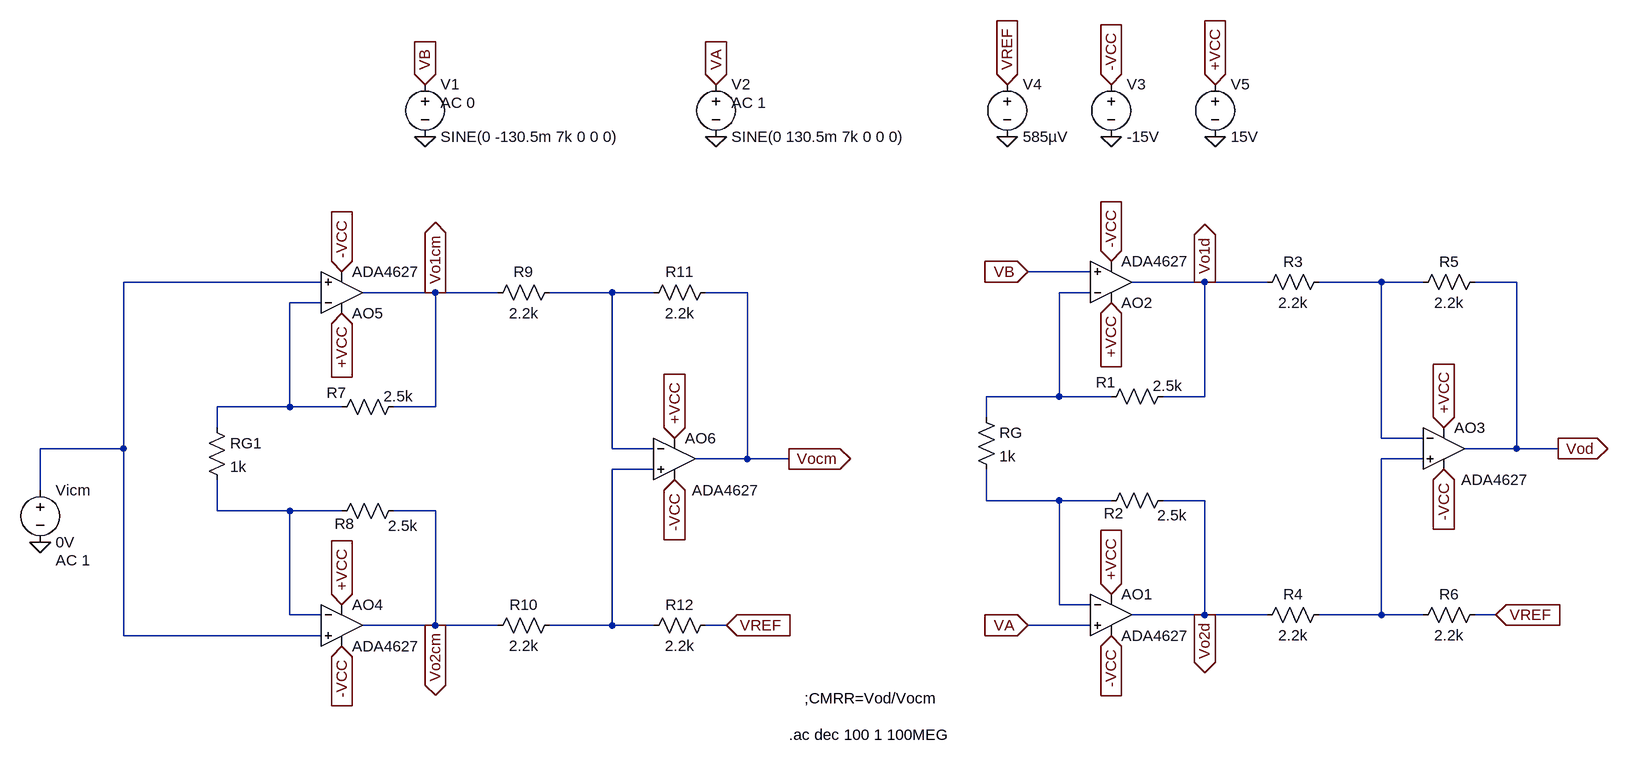
[diagram p0: schematic CMRR.asc]
CMRR.asc, the LTspice schematic file:
Version 4.1
SHEET 1 1332 680
WIRE -176 -80 -272 -80
WIRE -1360 -64 -1664 -64
WIRE 0 -64 -112 -64
WIRE 96 -64 0 -64
WIRE 272 -64 176 -64
WIRE 336 -64 272 -64
WIRE 480 -64 416 -64
WIRE -1184 -48 -1296 -48
WIRE -1088 -48 -1184 -48
WIRE -912 -48 -1008 -48
WIRE -848 -48 -912 -48
WIRE -704 -48 -768 -48
WIRE -176 -48 -224 -48
WIRE -1360 -32 -1408 -32
WIRE -224 112 -224 -48
WIRE -224 112 -336 112
WIRE -144 112 -224 112
WIRE 0 112 0 -64
WIRE 0 112 -64 112
WIRE -1408 128 -1408 -32
WIRE -1408 128 -1520 128
WIRE -1328 128 -1408 128
WIRE -1184 128 -1184 -48
WIRE -1184 128 -1248 128
WIRE -336 144 -336 112
WIRE -1520 160 -1520 128
WIRE 272 176 272 -64
WIRE 336 176 272 176
WIRE -1664 192 -1664 -64
WIRE -1664 192 -1792 192
WIRE -912 192 -912 -48
WIRE -848 192 -912 192
WIRE 480 192 480 -64
WIRE 480 192 400 192
WIRE 544 192 480 192
WIRE -704 208 -704 -48
WIRE -704 208 -784 208
WIRE -640 208 -704 208
WIRE 336 208 272 208
WIRE -848 224 -912 224
WIRE -1792 256 -1792 192
WIRE -336 272 -336 224
WIRE -224 272 -336 272
WIRE -144 272 -224 272
WIRE 0 272 -64 272
WIRE -1520 288 -1520 240
WIRE -1408 288 -1520 288
WIRE -1328 288 -1408 288
WIRE -1184 288 -1248 288
WIRE -224 432 -224 272
WIRE -176 432 -224 432
WIRE -1408 448 -1408 288
WIRE -1360 448 -1408 448
WIRE 0 448 0 272
WIRE 0 448 -112 448
WIRE 96 448 0 448
WIRE 272 448 272 208
WIRE 272 448 176 448
WIRE 336 448 272 448
WIRE 448 448 416 448
WIRE -1184 464 -1184 288
WIRE -1184 464 -1296 464
WIRE -1088 464 -1184 464
WIRE -912 464 -912 224
WIRE -912 464 -1008 464
WIRE -848 464 -912 464
WIRE -736 464 -768 464
WIRE -176 464 -272 464
WIRE -1664 480 -1664 192
WIRE -1360 480 -1664 480
FLAG -272 -80 VB
IOPIN -272 -80 In
FLAG -272 464 VA
IOPIN -272 464 In
FLAG -144 -96 -VCC
IOPIN -144 -96 In
FLAG -144 -32 +VCC
IOPIN -144 -32 In
FLAG -144 480 -VCC
IOPIN -144 480 In
FLAG -144 416 +VCC
IOPIN -144 416 In
FLAG 448 448 VREF
IOPIN 448 448 In
FLAG 0 -64 Vo1d
IOPIN 0 -64 Out
FLAG 0 448 Vo2d
IOPIN 0 448 Out
FLAG 368 224 -VCC
IOPIN 368 224 In
FLAG 368 160 +VCC
IOPIN 368 160 In
FLAG 544 192 Vod
IOPIN 544 192 Out
FLAG -1200 -288 0
FLAG -1200 -368 VB
IOPIN -1200 -368 In
FLAG -752 -288 0
FLAG -752 -368 VA
IOPIN -752 -368 In
FLAG -144 -288 0
FLAG 16 -288 0
FLAG 16 -368 +VCC
IOPIN 16 -368 In
FLAG -144 -368 -VCC
IOPIN -144 -368 In
FLAG -304 -288 0
FLAG -304 -368 VREF
IOPIN -304 -368 In
FLAG -1328 -80 -VCC
IOPIN -1328 -80 In
FLAG -1328 -16 +VCC
IOPIN -1328 -16 In
FLAG -1328 496 -VCC
IOPIN -1328 496 In
FLAG -1328 432 +VCC
IOPIN -1328 432 In
FLAG -736 464 VREF
IOPIN -736 464 In
FLAG -1184 -48 Vo1cm
IOPIN -1184 -48 Out
FLAG -1184 464 Vo2cm
IOPIN -1184 464 Out
FLAG -816 240 -VCC
IOPIN -816 240 In
FLAG -816 176 +VCC
IOPIN -816 176 In
FLAG -640 208 Vocm
IOPIN -640 208 Out
FLAG -1792 336 0
DATAFLAG 480 192 ""
DATAFLAG -704 208 ""
SYMBOL OpAmps\\ADA4627 -144 384 R0
SYMATTR InstName AO1
SYMBOL OpAmps\\ADA4627 -144 0 M180
SYMATTR InstName AO2
SYMBOL OpAmps\\ADA4627 368 128 R0
WINDOW 3 27 112 Left 2
SYMATTR InstName AO3
SYMBOL res -48 96 R90
WINDOW 0 10 104 VBottom 2
WINDOW 3 -16 9 VTop 2
SYMATTR InstName R1
SYMATTR Value 2.5k
SYMBOL res -48 256 R90
WINDOW 0 51 92 VBottom 2
WINDOW 3 23 2 VTop 2
SYMATTR InstName R2
SYMATTR Value 2.5k
SYMBOL res -352 128 R0
SYMATTR InstName RG
SYMATTR Value 1k
SYMBOL res 192 -80 R90
WINDOW 0 0 56 VBottom 2
WINDOW 3 32 56 VTop 2
SYMATTR InstName R3
SYMATTR Value 2.2k
SYMBOL res 192 432 R90
WINDOW 0 0 56 VBottom 2
WINDOW 3 32 56 VTop 2
SYMATTR InstName R4
SYMATTR Value 2.2k
SYMBOL res 432 -80 R90
WINDOW 0 0 56 VBottom 2
WINDOW 3 32 56 VTop 2
SYMATTR InstName R5
SYMATTR Value 2.2k
SYMBOL res 432 432 R90
WINDOW 0 0 56 VBottom 2
WINDOW 3 32 56 VTop 2
SYMATTR InstName R6
SYMATTR Value 2.2k
SYMBOL voltage -1200 -384 R0
WINDOW 123 24 44 Left 2
WINDOW 39 0 0 Left 0
SYMATTR Value2 AC 0
SYMATTR InstName V1
SYMATTR Value SINE(0 -130.5m 7k 0 0 0)
SYMBOL voltage -752 -384 R0
WINDOW 123 24 44 Left 2
WINDOW 39 0 0 Left 0
SYMATTR Value2 AC 1
SYMATTR InstName V2
SYMATTR Value SINE(0 130.5m 7k 0 0 0)
SYMBOL voltage -144 -384 R0
WINDOW 123 0 0 Left 0
WINDOW 39 0 0 Left 0
SYMATTR InstName V3
SYMATTR Value -15V
SYMBOL voltage -304 -384 R0
WINDOW 123 0 0 Left 0
WINDOW 39 0 0 Left 0
SYMATTR InstName V4
SYMATTR Value 585µV
SYMBOL voltage 16 -384 R0
WINDOW 123 24 44 Left 2
WINDOW 39 0 0 Left 0
SYMATTR InstName V5
SYMATTR Value 15V
SYMBOL OpAmps\\ADA4627 -1328 400 R0
SYMATTR InstName AO4
SYMBOL OpAmps\\ADA4627 -1328 16 M180
SYMATTR InstName AO5
SYMBOL OpAmps\\ADA4627 -816 144 R0
WINDOW 3 27 112 Left 2
SYMATTR InstName AO6
SYMBOL res -1232 112 R90
WINDOW 0 10 104 VBottom 2
WINDOW 3 -16 9 VTop 2
SYMATTR InstName R7
SYMATTR Value 2.5k
SYMBOL res -1232 272 R90
WINDOW 0 51 92 VBottom 2
WINDOW 3 23 2 VTop 2
SYMATTR InstName R8
SYMATTR Value 2.5k
SYMBOL res -1536 144 R0
SYMATTR InstName RG1
SYMATTR Value 1k
SYMBOL res -992 -64 R90
WINDOW 0 0 56 VBottom 2
WINDOW 3 32 56 VTop 2
SYMATTR InstName R9
SYMATTR Value 2.2k
SYMBOL res -992 448 R90
WINDOW 0 0 56 VBottom 2
WINDOW 3 32 56 VTop 2
SYMATTR InstName R10
SYMATTR Value 2.2k
SYMBOL res -752 -64 R90
WINDOW 0 0 56 VBottom 2
WINDOW 3 32 56 VTop 2
SYMATTR InstName R11
SYMATTR Value 2.2k
SYMBOL res -752 448 R90
WINDOW 0 0 56 VBottom 2
WINDOW 3 32 56 VTop 2
SYMATTR InstName R12
SYMATTR Value 2.2k
SYMBOL voltage -1792 240 R0
WINDOW 123 24 124 Left 2
WINDOW 39 0 0 Left 0
SYMATTR Value2 AC 1
SYMATTR InstName Vicm
SYMATTR Value 0V
TEXT -640 632 Left 2 !.ac dec 100 1 100MEG
TEXT -616 576 Left 2 !;CMRR=Vod/Vocm

The netlist it stands for:
* CMRR.asc
X§AO1 VA N008 +VCC -VCC Vo2d ADA4627  ; pins In+ In- V+ V- OUT
X§AO2 VB N004 +VCC -VCC Vo1d ADA4627  ; pins In+ In- V+ V- OUT
X§AO3 N006 N002 +VCC -VCC Vod ADA4627  ; pins In+ In- V+ V- OUT
R1 Vo1d N004 2.5k
R2 Vo2d N008 2.5k
RG N004 N008 1k
R3 N002 Vo1d 2.2k
R4 N006 Vo2d 2.2k
R5 Vod N002 2.2k
R6 VREF N006 2.2k
V1 VB 0 SINE(0 -130.5m 7k 0 0 0) AC 0
V2 VA 0 SINE(0 130.5m 7k 0 0 0) AC 1
V3 -VCC 0 -15V
V4 VREF 0 585µV
V5 +VCC 0 15V
X§AO4 N001 N009 +VCC -VCC Vo2cm ADA4627  ; pins In+ In- V+ V- OUT
X§AO5 N001 N005 +VCC -VCC Vo1cm ADA4627  ; pins In+ In- V+ V- OUT
X§AO6 N007 N003 +VCC -VCC Vocm ADA4627  ; pins In+ In- V+ V- OUT
R7 Vo1cm N005 2.5k
R8 Vo2cm N009 2.5k
RG1 N005 N009 1k
R9 N003 Vo1cm 2.2k
R10 N007 Vo2cm 2.2k
R11 Vocm N003 2.2k
R12 VREF N007 2.2k
Vicm N001 0 0V AC 1
.ac dec 100 1 100MEG
;CMRR=Vod/Vocm
.backanno
.end